# Altium schematic sheet FLUIDIC_CTRL.SchDoc
size 420 x 297 mm; SheetNumber: 17; SheetTotal: 19
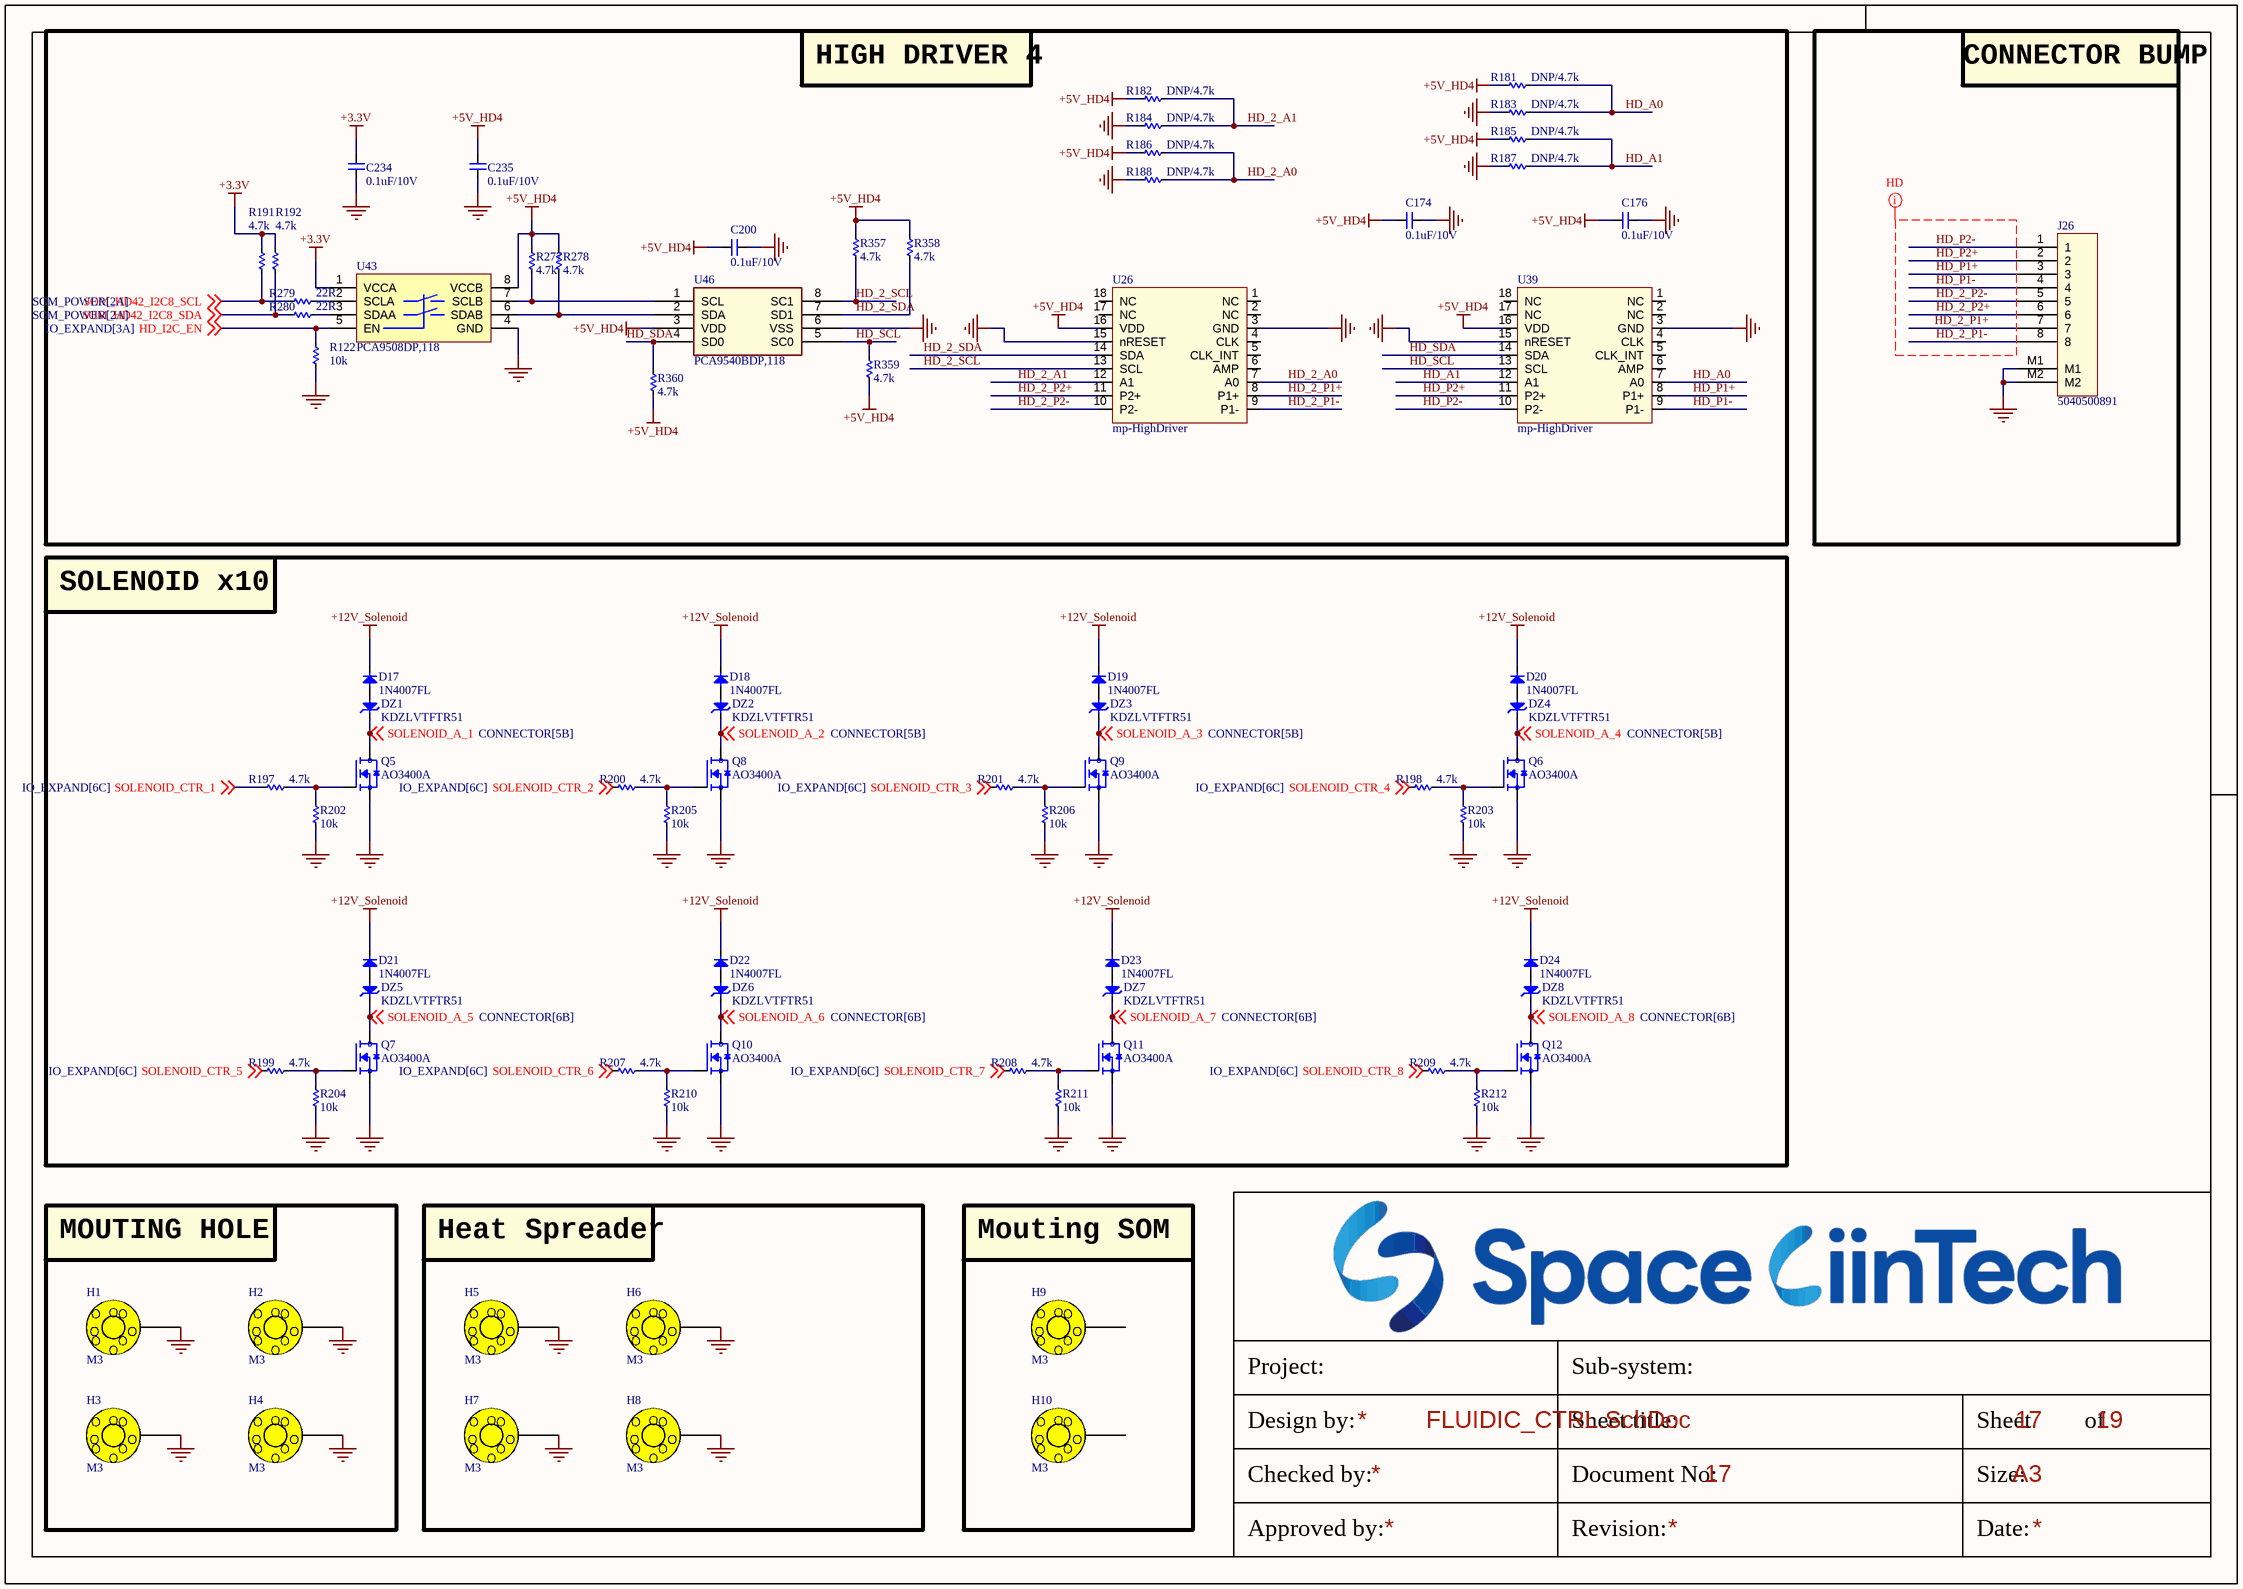
[diagram p0: FLUIDIC_CTRL.SchDoc]

## Parts
C174  0.1uF/10V  [CAP_C_1005X60]
C176  0.1uF/10V  [CAP_C_1005X60]
C200  0.1uF/10V  [CAP_C_1005X60]
C234  0.1uF/10V  [CAP_C_1005X60]
C235  0.1uF/10V  [CAP_C_1005X60]
D17  1N4007FL  [DIO-SMD-106]
D18  1N4007FL  [DIO-SMD-106]
D19  1N4007FL  [DIO-SMD-106]
D20  1N4007FL  [DIO-SMD-106]
D21  1N4007FL  [DIO-SMD-106]
D22  1N4007FL  [DIO-SMD-106]
D23  1N4007FL  [DIO-SMD-106]
D24  1N4007FL  [DIO-SMD-106]
DZ1  KDZLVTFTR51  [DIO-0.5A-SMALL]
DZ2  KDZLVTFTR51  [DIO-0.5A-SMALL]
DZ3  KDZLVTFTR51  [DIO-0.5A-SMALL]
DZ4  KDZLVTFTR51  [DIO-0.5A-SMALL]
DZ5  KDZLVTFTR51  [DIO-0.5A-SMALL]
DZ6  KDZLVTFTR51  [DIO-0.5A-SMALL]
DZ7  KDZLVTFTR51  [DIO-0.5A-SMALL]
DZ8  KDZLVTFTR51  [DIO-0.5A-SMALL]
H1  M3  [HEX-M3]
H2  M3  [HEX-M3]
H3  M3  [HEX-M3]
H4  M3  [HEX-M3]
H5  M3  [HEX-M3]
H6  M3  [HEX-M3]
H7  M3  [HEX-M3]
H8  M3  [HEX-M3]
H9  M3  [Testpoint_TH_D400H200]
H10  M3  [Testpoint_TH_D400H200]
J26  5040500891  [MOLEX_5040500891]
Q5  AO3400A  [SOT95P240X120-3N]
Q6  AO3400A  [SOT95P240X120-3N]
Q7  AO3400A  [SOT95P240X120-3N]
Q8  AO3400A  [SOT95P240X120-3N]
Q9  AO3400A  [SOT95P240X120-3N]
Q10  AO3400A  [SOT95P240X120-3N]
Q11  AO3400A  [SOT95P240X120-3N]
Q12  AO3400A  [SOT95P240X120-3N]
R122  10k  [RES_C_1005X40]
R181  DNP/4.7k  [RES_C_1005X40]
R182  DNP/4.7k  [RES_C_1005X40]
R183  DNP/4.7k  [RES_C_1005X40]
R184  DNP/4.7k  [RES_C_1005X40]
R185  DNP/4.7k  [RES_C_1005X40]
R186  DNP/4.7k  [RES_C_1005X40]
R187  DNP/4.7k  [RES_C_1005X40]
R188  DNP/4.7k  [RES_C_1005X40]
R191  4.7k  [RES_C_1005X40]
R192  4.7k  [RES_C_1005X40]
R197  4.7k  [RES_C_1005X40]
R198  4.7k  [RES_C_1005X40]
R199  4.7k  [RES_C_1005X40]
R200  4.7k  [RES_C_1005X40]
R201  4.7k  [RES_C_1005X40]
R202  10k  [RES_C_1005X40]
R203  10k  [RES_C_1005X40]
R204  10k  [RES_C_1005X40]
R205  10k  [RES_C_1005X40]
R206  10k  [RES_C_1005X40]
R207  4.7k  [RES_C_1005X40]
R208  4.7k  [RES_C_1005X40]
R209  4.7k  [RES_C_1005X40]
R210  10k  [RES_C_1005X40]
R211  10k  [RES_C_1005X40]
R212  10k  [RES_C_1005X40]
R277  4.7k  [RES_C_1005X40]
R278  4.7k  [RES_C_1005X40]
R279  22R  [RES_C_1005X40]
R280  22R  [RES_C_1005X40]
R357  4.7k  [RES_C_1005X40]
R358  4.7k  [RES_C_1005X40]
R359  4.7k  [RES_C_1005X40]
R360  4.7k  [RES_C_1005X40]
U26  mp-HighDriver  [MP_HIGHDRIVER]
U39  mp-HighDriver  [MP_HIGHDRIVER]
U43  PCA9508DP,118  [TSOP8]
U46  PCA9540BDP,118  [SOP65P510X110X300W-8]

## Blocks framed on the sheet
HIGH DRIVER 4: C174 C176 C200 C234 C235 R122 R181-R188 R191 R192 R277-R280 R357-R360 U26 U39 U43 U46
CONNECTOR BUMP: J26
SOLENOID x10: D17-D24 DZ1-DZ8 Q5-Q12 R197-R212
MOUTING HOLE: H1-H4
Heat Spreader: H5-H8
Mouting SOM: H9 H10

## Nets
+3.3V: C234.2 R191.1 R192.1 U43.1(VCCA)
+5V_HD4: C174.2 C176.2 C200.2 C235.2 R181.1 R182.1 R185.1 R186.1 R277.1 R278.1 R357.1 R358.1 R359.1 R360.1 U26.16(VDD) U39.16(VDD) U43.8(VCCB) U46.3(VDD)
+12V_Solenoid: D17.1(K) D18.1(K) D19.1(K) D20.1(K) D21.1(K) D22.1(K) D23.1(K) D24.1(K)
GND: C174.1 C176.1 C200.1 C234.1 C235.1 H1.1 H2.1 H3.1 H4.1 H5.1 H6.1 H7.1 H8.1 J26.M1 J26.M2 Q5.2(S) Q6.2(S) Q7.2(S) Q8.2(S) Q9.2(S) Q10.2(S) Q11.2(S) Q12.2(S) R122.2 R183.1 R184.1 R187.1 R188.1 R202.1 R203.1 R204.1 R205.1 R206.1 R210.1 R211.1 R212.1 U26.3(GND) U26.15(nRESET) U39.3(GND) U39.15(nRESET) U43.4(GND) U46.6(VSS)
HD_2_A0: R186.2 R188.2 U26.7(A0)
HD_2_A1: R182.2 R184.2 U26.12(A1)
HD_2_P1+: J26.7 U26.8(P1+)
HD_2_P1-: J26.8 U26.9(P1-)
HD_2_P2+: J26.6 U26.11(P2+)
HD_2_P2-: J26.5 U26.10(P2-)
HD_2_SCL: R357.2 U26.13(SCL) U46.8(SC1)
HD_2_SDA: R358.2 U26.14(SDA) U46.7(SD1)
HD_A0: R181.2 R183.2 U39.7(A0)
HD_A1: R185.2 R187.2 U39.12(A1)
HD_I2C_EN: R122.1 U43.5(EN) ; off-sheet HD_I2C_EN
HD_P1+: J26.3 U39.8(P1+)
HD_P1-: J26.4 U39.9(P1-)
HD_P2+: J26.2 U39.11(P2+)
HD_P2-: J26.1 U39.10(P2-)
HD_SCL: R359.2 U39.13(SCL) U46.5(SC0)
HD_SDA: R360.2 U39.14(SDA) U46.4(SD0)
SOLENOID_A_1: DZ1.1(K) Q5.3(D) ; off-sheet SOLENOID_A_1
SOLENOID_A_2: DZ2.1(K) Q8.3(D) ; off-sheet SOLENOID_A_2
SOLENOID_A_3: DZ3.1(K) Q9.3(D) ; off-sheet SOLENOID_A_3
SOLENOID_A_4: DZ4.1(K) Q6.3(D) ; off-sheet SOLENOID_A_4
SOLENOID_A_5: DZ5.1(K) Q7.3(D) ; off-sheet SOLENOID_A_5
SOLENOID_A_6: DZ6.1(K) Q10.3(D) ; off-sheet SOLENOID_A_6
SOLENOID_A_7: DZ7.1(K) Q11.3(D) ; off-sheet SOLENOID_A_7
SOLENOID_A_8: DZ8.1(K) Q12.3(D) ; off-sheet SOLENOID_A_8
SOLENOID_CTR_1: R197.2 ; off-sheet SOLENOID_CTR_1
SOLENOID_CTR_2: R200.2 ; off-sheet SOLENOID_CTR_2
SOLENOID_CTR_3: R201.2 ; off-sheet SOLENOID_CTR_3
SOLENOID_CTR_4: R198.2 ; off-sheet SOLENOID_CTR_4
SOLENOID_CTR_5: R199.2 ; off-sheet SOLENOID_CTR_5
SOLENOID_CTR_6: R207.2 ; off-sheet SOLENOID_CTR_6
SOLENOID_CTR_7: R208.2 ; off-sheet SOLENOID_CTR_7
SOLENOID_CTR_8: R209.2 ; off-sheet SOLENOID_CTR_8
SOM_HD42_I2C8_SCL: R191.2 R279.2 ; off-sheet SOM_HD42_I2C8_SCL
SOM_HD42_I2C8_SDA: R192.2 R280.2 ; off-sheet SOM_HD42_I2C8_SDA
NetD17_2: D17.2(A) DZ1.2(A)
NetD18_2: D18.2(A) DZ2.2(A)
NetD19_2: D19.2(A) DZ3.2(A)
NetD20_2: D20.2(A) DZ4.2(A)
NetD21_2: D21.2(A) DZ5.2(A)
NetD22_2: D22.2(A) DZ6.2(A)
NetD23_2: D23.2(A) DZ7.2(A)
NetD24_2: D24.2(A) DZ8.2(A)
NetQ5_1: Q5.1(G) R197.1 R202.2
NetQ6_1: Q6.1(G) R198.1 R203.2
NetQ7_1: Q7.1(G) R199.1 R204.2
NetQ8_1: Q8.1(G) R200.1 R205.2
NetQ9_1: Q9.1(G) R201.1 R206.2
NetQ10_1: Q10.1(G) R207.1 R210.2
NetQ11_1: Q11.1(G) R208.1 R211.2
NetQ12_1: Q12.1(G) R209.1 R212.2
NetR277_2: R277.2 U43.7(SCLB) U46.1(SCL)
NetR278_2: R278.2 U43.6(SDAB) U46.2(SDA)
NetR279_1: R279.1 U43.2(SCLA)
NetR280_1: R280.1 U43.3(SDAA)

Not connected (* = marked no-connect by the designer): H9 1; H10 1; U26 1(NC) 2(NC) 4(CLK) 5(CLK_INT) 6(AMP) 17(NC) 18(NC); U39 1(NC) 2(NC) 4(CLK) 5(CLK_INT) 6(AMP) 17(NC) 18(NC)

## Layout directives
net class HD: HD_2_P1+, HD_2_P1-, HD_2_P2+, HD_2_P2-, HD_P1+, HD_P1-, HD_P2+, HD_P2-

## Notes on the sheet
- Project:
- Sub-system:
- Design by:
- Sheet title:
- Sheet
- of
- Checked by:
- Approved by:
- Revision:
- Document No:
- Size:
- Date:
- A3

## Library data of the parts
C174 C176 C200 C234 C235 = _CAP_C_2: CAP CHIP
D17-D24 = Diode SMD: Default Diode; Code - JEDEC: DO-214-AB; Value: 1N5007; Published: 8-Jun-2000; Revision: July-2002: Re-released for DXP Platform.; Publisher: Altium Limited
DZ1-DZ8 = DIODE Zener: Zenner
H1-H10 = HEX-M3
J26 = Header 8x1_2M
Q5-Q12 = MOSFET_N: N-Channel 30 V 5.7A (Ta) 1.4W (Ta) Surface Mount SOT-23-3; MF: Alpha & Omega Semiconductor; SnapEDA_Link: https://www.snapeda.com/parts/AO3400A/Alpha/view-part/?ref=snap; Package: SOT-23 Alpha &amp; Omega Semiconductor Inc.; Value: *; MP: AO3400A; Check_prices: https://www.snapeda.com/parts/AO3400A/Alpha/view-part/?ref=eda
R122 R181-R188 R191 R192 R197-R212 R277-R280 R357-R360 = _RES_B_2: RES
U46 = IC_I2C_Mux_PCA9540BDP,118: IC INTERFACE SPECIALIZED